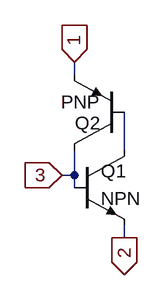
[diagram p0: schematic CAS14bx.asc]
CAS14bx.asc, the LTspice schematic file:
Version 4
SHEET 1 880 680
WIRE 160 144 160 128
WIRE 224 240 224 192
WIRE 160 272 160 240
WIRE 160 272 144 272
WIRE 160 288 160 272
WIRE 224 352 224 336
FLAG 160 128 1
IOPIN 160 128 In
FLAG 144 272 3
IOPIN 144 272 In
FLAG 224 352 2
IOPIN 224 352 Out
SYMBOL npn 160 240 R0
WINDOW 0 34 27 Left 2
WINDOW 3 34 62 Left 2
SYMATTR InstName Q1
SYMBOL pnp 224 240 R180
WINDOW 0 31 34 Left 2
WINDOW 3 32 61 Left 2
SYMATTR InstName Q2

The netlist it stands for:
* CAS14bx.asc
Q1 N001 3 2 0 NPN
Q2 3 N001 1 0 PNP
.model NPN NPN
.model PNP PNP
.lib standard.bjt
.backanno
.end